# Altium schematic sheet CH32L&VxxCx_Touch_Kit.SchDoc
size A4
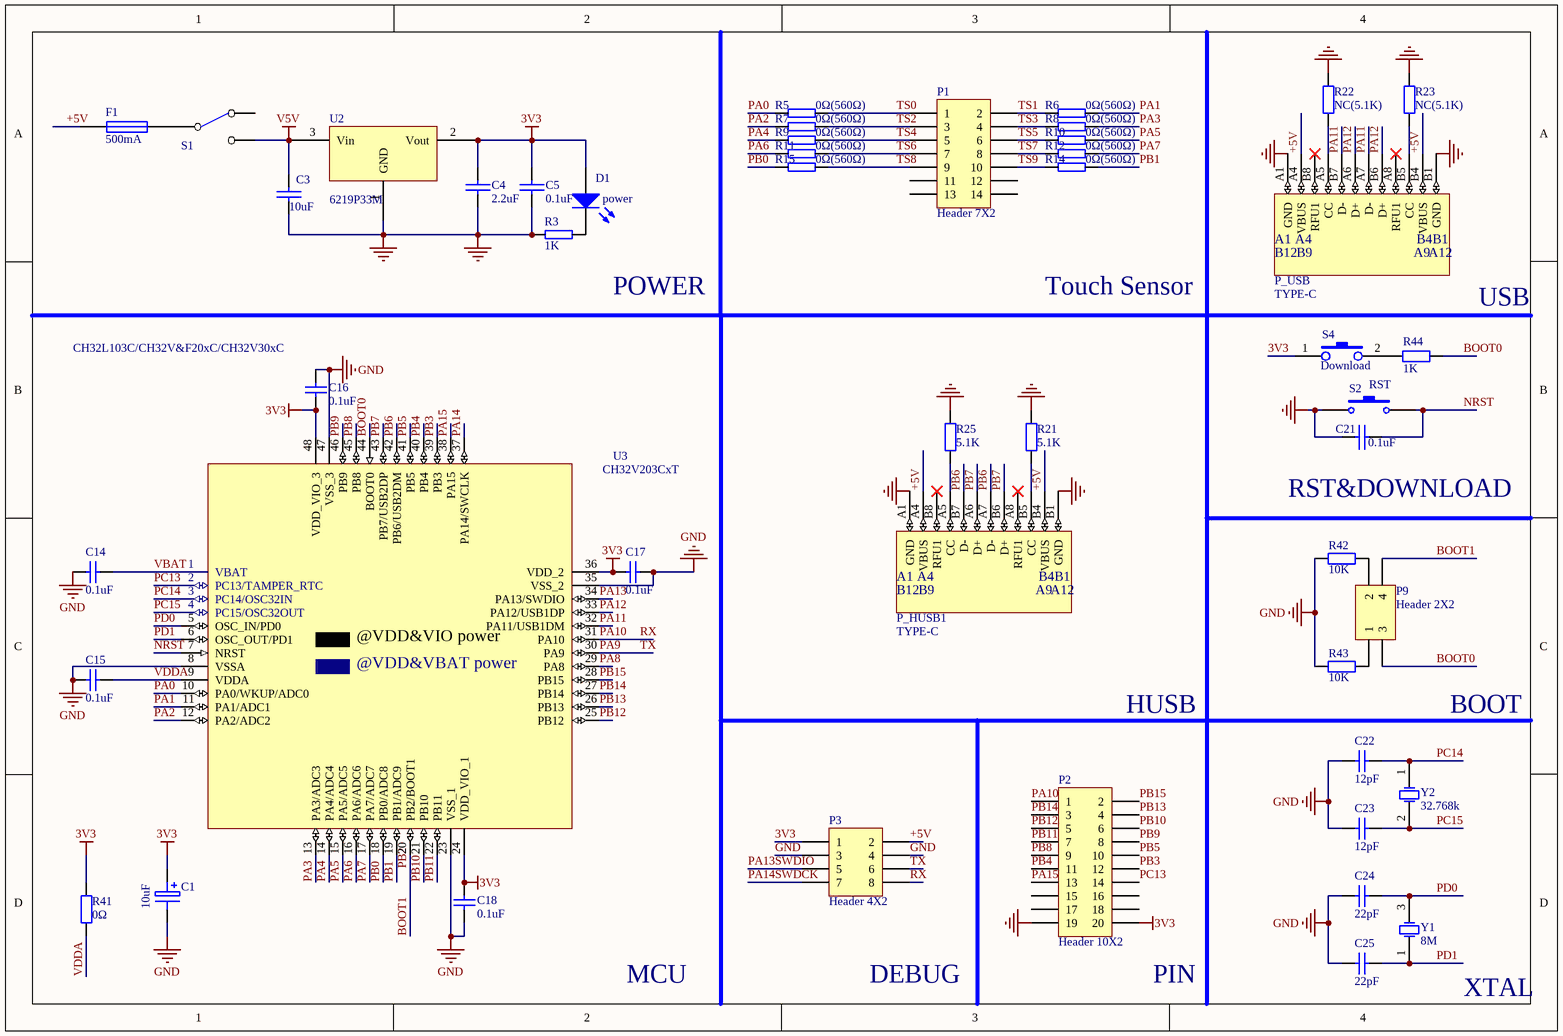
[diagram p0: CH32L&VxxCx_Touch_Kit.SchDoc]

## Parts
C1  10uF  [CASE-A_3216]
C3  10uF  [0603_C]
C4  2.2uF  [0402_C]
C5  0.1uF  [0402_C]
C14  0.1uF  [0402_C]
C15  0.1uF  [0402_C]
C16  0.1uF  [0402_C]
C17  0.1uF  [0402_C]
C18  0.1uF  [0402_C]
C21  0.1uF  [0402_C]
C22  12pF  [0402_C]
C23  12pF  [0402_C]
C24  22pF  [0402_C]
C25  22pF  [0402_C]
D1  power  [0603+]
F1  500mA  [0603]
P1  Header 7X2  [HDR-TH_14P-P2.54-H-M-R2-C10-S2.54]
P2  Header 10X2  [HDR-TH_20P-P2.54-H-M-R2-C10-S2.54]
P3  Header 4X2  [IDC8-2.54mm]
P9  Header 2X2  [IDC4-2.54mm]
P_HUSB1  TYPE-C  [TYPE-C-Receptacle-2.0]
P_USB  TYPE-C  [TYPE-C-Receptacle-2.0]
R3  1K  [0402]
R5  0Ω(560Ω)  [0402]
R6  0Ω(560Ω)  [0402]
R7  0Ω(560Ω)  [0402]
R8  0Ω(560Ω)  [0402]
R9  0Ω(560Ω)  [0402]
R10  0Ω(560Ω)  [0402]
R11  0Ω(560Ω)  [0402]
R12  0Ω(560Ω)  [0402]
R14  0Ω(560Ω)  [0402]
R15  0Ω(560Ω)  [0402]
R21  5.1K  [0402]
R22  NC(5.1K)  [0402]
R23  NC(5.1K)  [0402]
R25  5.1K  [0402]
R41  0Ω  [0402]
R42  10K  [0402]
R43  10K  [0402]
R44  1K  [0402]
S1  SW SPDT  [SW1]  (value not drawn)
S2  RST  [SMD_6.1x3.65x2.5mm-KEY]
S4  Download  [SMD_6.1x3.65x2.5mm-KEY]
U2  6219P33M  [SOT-23]
U3  CH32V203CxT  [LQFP48]
Y1  8M  [XT3225]
Y2  32.768k  [FC-135]

## Nets
3V3: C1.1 C4.1 C5.1 C16.2 C17.2 C18.2 D1.1(A) P2.20 P3.1 R41.1 S4.1 U2.2(Vout) U3.24(VDD_VIO_1) U3.36(VDD_2) U3.48(VDD_VIO_3)
GND: C1.2 C3.2 C4.2 C5.2 C14.2 C15.2 C16.1 C17.1 C18.1 C21.1 C22.2 C23.2 C24.1 C25.1 P2.19 P3.3 P3.4 P_HUSB1.A1(GND) P_HUSB1.B1(GND) P_USB.A1(GND) P_USB.B1(GND) R3.2 R21.2 R22.2 R23.2 R25.2 R42.2 R43.2 S2.1 U2.1(GND) U3.8(VSSA) U3.23(VSS_1) U3.35(VSS_2) U3.47(VSS_3)
V5V: C3.1 S1.2(NC) U2.3(Vin)
+5V: F1.1 P3.2 P_HUSB1.A4(VBUS) P_HUSB1.B4(VBUS) P_USB.A4(VBUS) P_USB.B4(VBUS)
BOOT0: P9.3 R44.1 U3.44(BOOT0)
BOOT1: P9.4 U3.20(PB2/BOOT1)  [also labelled PB2]
NRST: C21.2 S2.2 U3.7(NRST)
PA0: R5.1 U3.10(PA0/WKUP/ADC0)
PA1: R6.2 U3.11(PA1/ADC1)
PA2: R7.1 U3.12(PA2/ADC2)
PA3: R8.2 U3.13(PA3/ADC3)
PA4: R9.1 U3.14(PA4/ADC4)
PA5: R10.2 U3.15(PA5/ADC5)
PA6: R11.1 U3.16(PA6/ADC6)
PA7: R12.2 U3.17(PA7/ADC7)
PA8: U3.29(PA8)
PA9: P3.6 U3.30(PA9)  [also labelled TX]
PA10: P2.1 P3.8 U3.31(PA10)  [also labelled RX]
PA11: P_USB.A7(D-) P_USB.B7(D-) U3.32(PA11/USB1DM)
PA12: P_USB.A6(D+) P_USB.B6(D+) U3.33(PA12/USB1DP)
PA13: P3.5 U3.34(PA13/SWDIO)  [also labelled SWDIO]
PA14: P3.7 U3.37(PA14/SWCLK)  [also labelled SWDCK]
PA15: P2.13 U3.38(PA15)
PB0: R15.1 U3.18(PB0/ADC8)
PB1: R14.2 U3.19(PB1/ADC9)
PB3: P2.12 U3.39(PB3)
PB4: P2.11 U3.40(PB4)
PB5: P2.10 U3.41(PB5)
PB6: P_HUSB1.A7(D-) P_HUSB1.B7(D-) U3.42(PB6/USB2DM)
PB7: P_HUSB1.A6(D+) P_HUSB1.B6(D+) U3.43(PB7/USB2DP)
PB8: P2.9 U3.45(PB8)
PB9: P2.8 U3.46(PB9)
PB10: P2.6 U3.21(PB10)
PB11: P2.7 U3.22(PB11)
PB12: P2.5 U3.25(PB12)
PB13: P2.4 U3.26(PB13)
PB14: P2.3 U3.27(PB14)
PB15: P2.2 U3.28(PB15)
PC13: P2.14 U3.2(PC13/TAMPER_RTC)
PC14: C22.1 U3.3(PC14/OSC32IN) Y2.1(OSC1)
PC15: C23.1 U3.4(PC15/OSC32OUT) Y2.2(OSC2)
PD0: C24.2 U3.5(OSC_IN/PD0) Y1.3(OSC2)
PD1: C25.2 U3.6(OSC_OUT/PD1) Y1.1(OSC1)
TS0: P1.1 R5.2
TS1: P1.2 R6.1
TS2: P1.3 R7.2
TS3: P1.4 R8.1
TS4: P1.5 R9.2
TS5: P1.6 R10.1
TS6: P1.7 R11.2
TS7: P1.8 R12.1
TS8: P1.9 R15.2
TS9: P1.10 R14.1
VBAT: C14.1 U3.1(VBAT)
VDDA: C15.1 R41.2 U3.9(VDDA)
NetD1_2: D1.2(K) R3.1
NetF1_2: F1.2 S1.1(COMMON)
NetP9_1: P9.1 R43.1
NetP9_2: P9.2 R42.1
NetP_HUSB1_A5: P_HUSB1.A5(CC) R25.1
NetP_HUSB1_B5: P_HUSB1.B5(CC) R21.1
NetP_USB_A5: P_USB.A5(CC) R22.1
NetP_USB_B5: P_USB.B5(CC) R23.1
NetR44_2: R44.2 S4.2

Not connected (* = marked no-connect by the designer): P1 11 12 13 14; P2 15 16 17 18; P_HUSB1 A8(RFU1)* B8(RFU1)*; P_USB A8(RFU1)* B8(RFU1)*; S1 3(NO)

## Notes on the sheet
- POWER
- Touch Sensor
- USB
- CH32L103C/CH32V&F20xC/CH32V30xC
- RST&DOWNLOAD
- HUSB
- BOOT
- MCU
- DEBUG
- PIN
- XTAL
- (in symbol CH32V203CxT) @VDD&VIO power; @VDD&VBAT power
- (in symbol TYPE-C1) B12; B9; A9; A12

## Library data of the parts
C1 = T-A/4.7uF/16V
C3-C5 C21 = CAP: Capacitor
C14-C18 C22-C25 = Cap: Capacitor; Published: 8-Jun-2000; LatestRevisionDate: 17-Jul-2002; LatestRevisionNote: Re-released for DXP Platform.; PackageReference: RAD-0.3; Publisher: Altium Limited
D1 = LED0: Typical INFRARED GaAs LED; Published: 8-Jun-2000; LatestRevisionDate: 08-Jul-2005; LatestRevisionNote: Mech Layer 1 removed.; PackageReference: LED-0; Publisher: Altium Limited; PackageDescription: LED; 2 Leads
F1 = FUSE1: Fuse
P1 = Header 7X2: Header, 7-Pin, Dual row; LatestRevisionDate: 17-Jul-2002; LatestRevisionNote: Re-released for DXP Platform.; Publisher: Altium Limited
P2 = Header 10X2: Header, 10-Pin, Dual row; LatestRevisionDate: 17-Jul-2002; LatestRevisionNote: Re-released for DXP Platform.; Publisher: Altium Limited
P3 = Header 4X2: Header, 4-Pin, Dual row; LatestRevisionDate: 17-Jul-2002; LatestRevisionNote: Re-released for DXP Platform.; Publisher: Altium Limited
P9 = Header 2X2: Header, 2-Pin, Dual row; LatestRevisionDate: 17-Jul-2002; LatestRevisionNote: Re-released for DXP Platform.; Publisher: Altium Limited
P_HUSB1 P_USB = TYPE-C1
R3 R5-R12 R14 R15 = RES
R21-R23 R25 R41-R44 = Res2: Resistor
  R41 R44: Published: 8-Jun-2000; LatestRevisionDate: 17-Jul-2002; LatestRevisionNote: Re-released for DXP Platform.; PackageReference: AXIAL-0.4; Publisher: Altium Limited
  R42 R43: Published: 8-Jun-2000; LatestRevisionDate: 17-Jul-2002; LatestRevisionNote: Re-released for DXP Platform.; PackageReference: AXIAL-0.4; Publisher: Altium Limited; Value: 10K
S2 = SW-PB: Switch; Published: 24-Mar-1999; LatestRevisionDate: 17-Jul-2002; LatestRevisionNote: Re-released for DXP Platform.; PackageReference: SPST-2; Publisher: Altium Limited; PackageDescription: Switch; 2 Leads
S4 = KEY1
U3 = CH32V203CxT: RISC-V LMD-MCU, 144MHz, 2*USB FS, CAN
Y1 Y2 = XTAL: Crystal Oscillator; Published: 8-Jun-2000; LatestRevisionDate: 17-Jul-2002; LatestRevisionNote: Re-released for DXP Platform.; PackageReference: R38; Publisher: Altium Limited